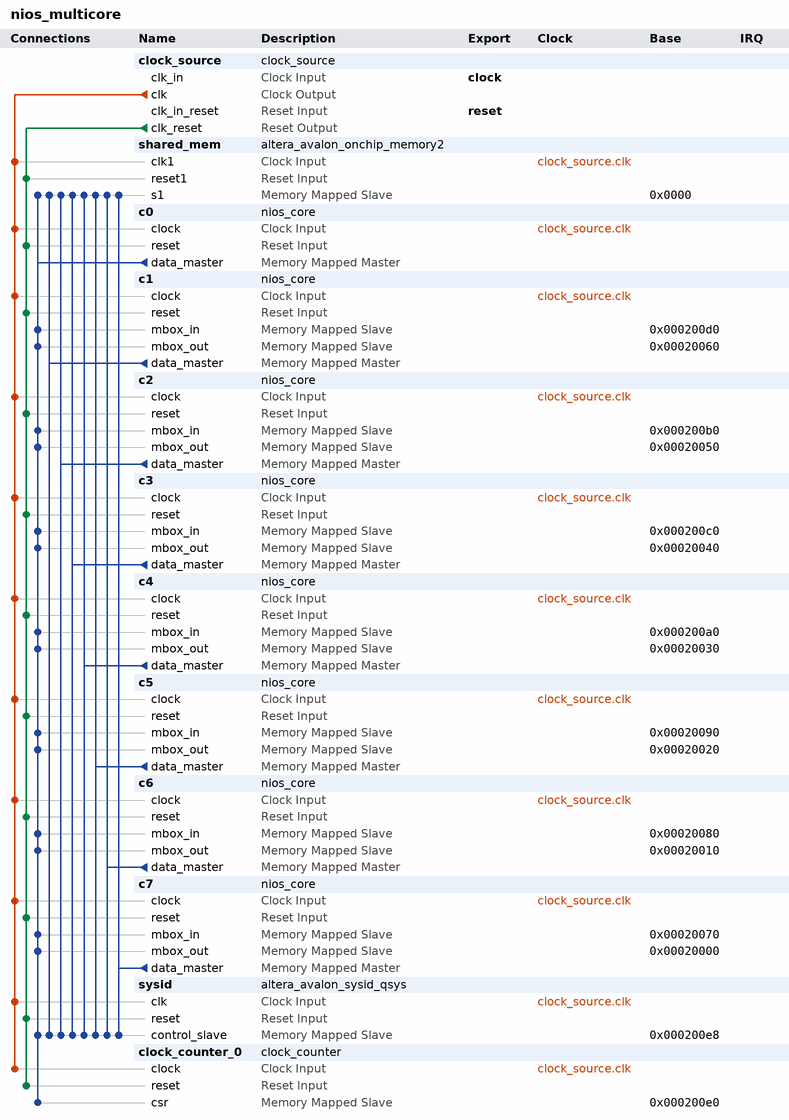
[diagram p0: system contents]
# Platform Designer (Qsys) system nios_multicore, Cyclone IV E EP4CE115F29C7
# Parameters at their usual value, and those the tool derives, are not listed.
package require -exact qsys 18.1
create_system nios_multicore
set_project_property DEVICE_FAMILY {Cyclone IV E}
set_project_property DEVICE EP4CE115F29C7

add_instance clock_source clock_source 18.1
set_instance_parameter_value clock_source clockFrequency 50000000

add_instance shared_mem altera_avalon_onchip_memory2 18.1
set_instance_parameter_value shared_mem dataWidth 32
set_instance_parameter_value shared_mem dualPort false
set_instance_parameter_value shared_mem initMemContent false
set_instance_parameter_value shared_mem initializationFileName onchip_mem.hex
set_instance_parameter_value shared_mem memorySize 131072

add_instance c0 nios_core 1.0

add_instance c1 nios_core 1.0

add_instance c2 nios_core 1.0

add_instance c3 nios_core 1.0

add_instance c4 nios_core 1.0

add_instance c5 nios_core 1.0

add_instance c6 nios_core 1.0

add_instance c7 nios_core 1.0

add_instance sysid altera_avalon_sysid_qsys 18.1
set_instance_parameter_value sysid id -559038737

add_instance clock_counter_0 clock_counter 1.0

# connections
add_connection clock_source.clk c0.clock clock
add_connection clock_source.clk c1.clock clock
add_connection clock_source.clk c2.clock clock
add_connection clock_source.clk c3.clock clock
add_connection clock_source.clk c4.clock clock
add_connection clock_source.clk c5.clock clock
add_connection clock_source.clk c6.clock clock
add_connection clock_source.clk c7.clock clock
add_connection clock_source.clk clock_counter_0.clock clock
add_connection clock_source.clk shared_mem.clk1 clock
add_connection clock_source.clk sysid.clk clock
add_connection clock_source.clk_reset c0.reset reset
add_connection clock_source.clk_reset c1.reset reset
add_connection clock_source.clk_reset c2.reset reset
add_connection clock_source.clk_reset c3.reset reset
add_connection clock_source.clk_reset c4.reset reset
add_connection clock_source.clk_reset c5.reset reset
add_connection clock_source.clk_reset c6.reset reset
add_connection clock_source.clk_reset c7.reset reset
add_connection clock_source.clk_reset clock_counter_0.reset reset
add_connection clock_source.clk_reset shared_mem.reset1 reset
add_connection clock_source.clk_reset sysid.reset reset
add_connection c0.data_master c1.mbox_in avalon
set_connection_parameter_value c0.data_master/c1.mbox_in baseAddress 0x000200d0
add_connection c0.data_master c1.mbox_out avalon
set_connection_parameter_value c0.data_master/c1.mbox_out baseAddress 0x00020060
add_connection c0.data_master c2.mbox_in avalon
set_connection_parameter_value c0.data_master/c2.mbox_in baseAddress 0x000200b0
add_connection c0.data_master c2.mbox_out avalon
set_connection_parameter_value c0.data_master/c2.mbox_out baseAddress 0x00020050
add_connection c0.data_master c3.mbox_in avalon
set_connection_parameter_value c0.data_master/c3.mbox_in baseAddress 0x000200c0
add_connection c0.data_master c3.mbox_out avalon
set_connection_parameter_value c0.data_master/c3.mbox_out baseAddress 0x00020040
add_connection c0.data_master c4.mbox_in avalon
set_connection_parameter_value c0.data_master/c4.mbox_in baseAddress 0x000200a0
add_connection c0.data_master c4.mbox_out avalon
set_connection_parameter_value c0.data_master/c4.mbox_out baseAddress 0x00020030
add_connection c0.data_master c5.mbox_in avalon
set_connection_parameter_value c0.data_master/c5.mbox_in baseAddress 0x00020090
add_connection c0.data_master c5.mbox_out avalon
set_connection_parameter_value c0.data_master/c5.mbox_out baseAddress 0x00020020
add_connection c0.data_master c6.mbox_in avalon
set_connection_parameter_value c0.data_master/c6.mbox_in baseAddress 0x00020080
add_connection c0.data_master c6.mbox_out avalon
set_connection_parameter_value c0.data_master/c6.mbox_out baseAddress 0x00020010
add_connection c0.data_master c7.mbox_in avalon
set_connection_parameter_value c0.data_master/c7.mbox_in baseAddress 0x00020070
add_connection c0.data_master c7.mbox_out avalon
set_connection_parameter_value c0.data_master/c7.mbox_out baseAddress 0x00020000
add_connection c0.data_master clock_counter_0.csr avalon
set_connection_parameter_value c0.data_master/clock_counter_0.csr baseAddress 0x000200e0
add_connection c0.data_master shared_mem.s1 avalon
set_connection_parameter_value c0.data_master/shared_mem.s1 baseAddress 0x0000
add_connection c0.data_master sysid.control_slave avalon
set_connection_parameter_value c0.data_master/sysid.control_slave baseAddress 0x000200e8
add_connection c1.data_master shared_mem.s1 avalon
set_connection_parameter_value c1.data_master/shared_mem.s1 baseAddress 0x0000
add_connection c1.data_master sysid.control_slave avalon
set_connection_parameter_value c1.data_master/sysid.control_slave baseAddress 0x000200e8
add_connection c2.data_master shared_mem.s1 avalon
set_connection_parameter_value c2.data_master/shared_mem.s1 baseAddress 0x0000
add_connection c2.data_master sysid.control_slave avalon
set_connection_parameter_value c2.data_master/sysid.control_slave baseAddress 0x000200e8
add_connection c3.data_master shared_mem.s1 avalon
set_connection_parameter_value c3.data_master/shared_mem.s1 baseAddress 0x0000
add_connection c3.data_master sysid.control_slave avalon
set_connection_parameter_value c3.data_master/sysid.control_slave baseAddress 0x000200e8
add_connection c4.data_master shared_mem.s1 avalon
set_connection_parameter_value c4.data_master/shared_mem.s1 baseAddress 0x0000
add_connection c4.data_master sysid.control_slave avalon
set_connection_parameter_value c4.data_master/sysid.control_slave baseAddress 0x000200e8
add_connection c5.data_master shared_mem.s1 avalon
set_connection_parameter_value c5.data_master/shared_mem.s1 baseAddress 0x0000
add_connection c5.data_master sysid.control_slave avalon
set_connection_parameter_value c5.data_master/sysid.control_slave baseAddress 0x000200e8
add_connection c6.data_master shared_mem.s1 avalon
set_connection_parameter_value c6.data_master/shared_mem.s1 baseAddress 0x0000
add_connection c6.data_master sysid.control_slave avalon
set_connection_parameter_value c6.data_master/sysid.control_slave baseAddress 0x000200e8
add_connection c7.data_master shared_mem.s1 avalon
set_connection_parameter_value c7.data_master/shared_mem.s1 baseAddress 0x0000
add_connection c7.data_master sysid.control_slave avalon
set_connection_parameter_value c7.data_master/sysid.control_slave baseAddress 0x000200e8

# exported interfaces
add_interface clock clock sink
set_interface_property clock EXPORT_OF clock_source.clk_in
add_interface reset reset sink
set_interface_property reset EXPORT_OF clock_source.clk_in_reset

set_interconnect_requirement {$system} qsys_mm.clockCrossingAdapter HANDSHAKE
set_interconnect_requirement {$system} qsys_mm.enableEccProtection FALSE
set_interconnect_requirement {$system} qsys_mm.insertDefaultSlave FALSE
set_interconnect_requirement {$system} qsys_mm.maxAdditionalLatency 1

save_system nios_multicore.qsys
